# EAGLE schematic hub4 (EAGLE 6.6.0)
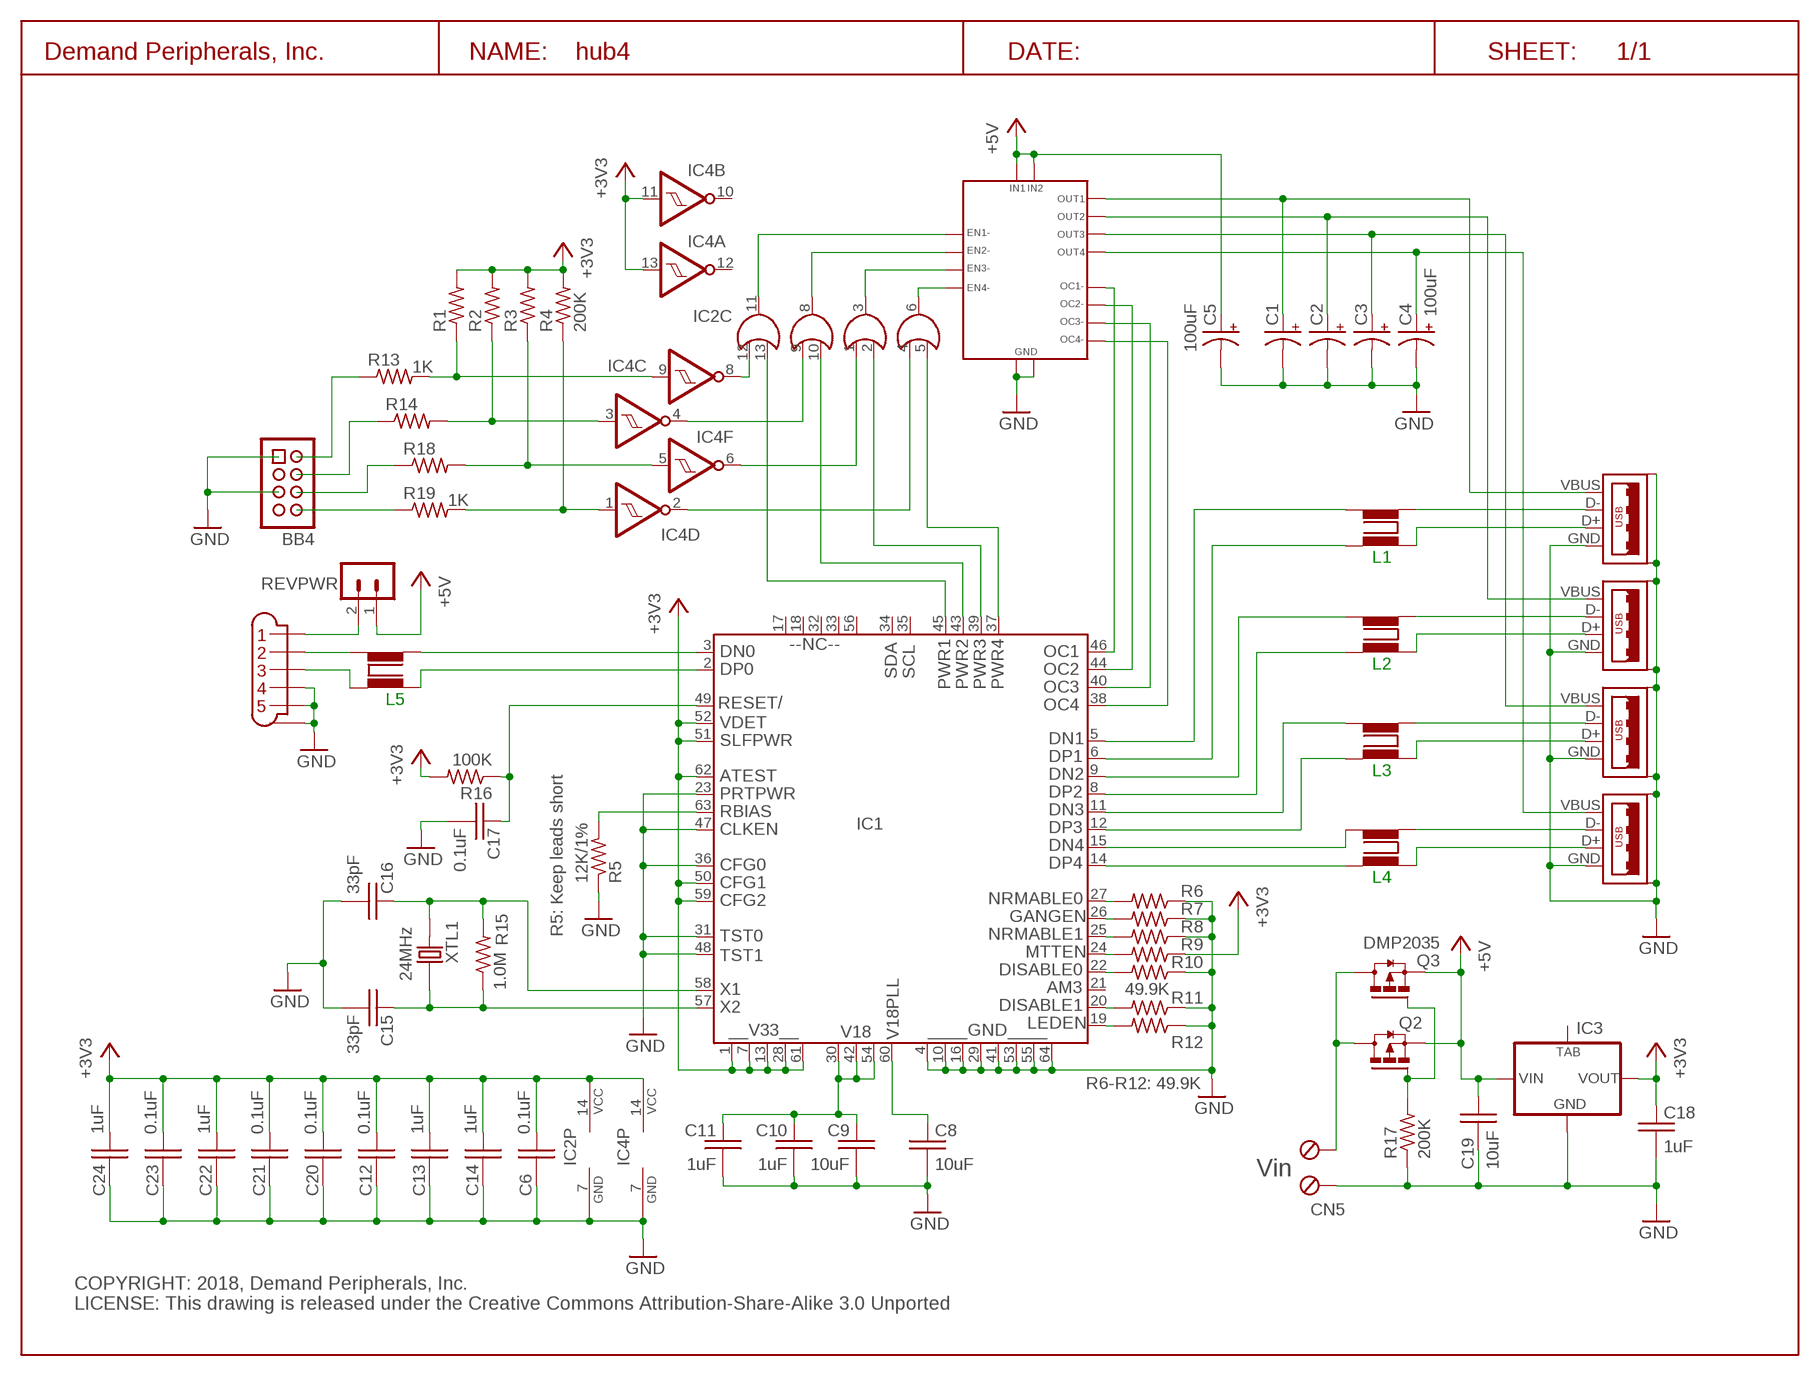
[diagram p0: schematic, sheet 1]

## Parts
BB4  HDR-4X2-SHR  [HDR-4X2]
C1  100uF  C100UF35V_E3.5-8  [E3.5-8]
C2  100uF  C100UF35V_E3.5-8  [E3.5-8]
C3  100uF  C100UF35V_E3.5-8  [E3.5-8]
C4  100uF  C100UF35V_E3.5-8  [E3.5-8]
C5  100uF  C100UF35V_E3.5-8  [E3.5-8]
C6  0.1uF  C0.1UF_C0603  [C0603]
C8  10uF  C10UF35V_C0805  [C0805]
C9  10uF  C10UF35V_C0805  [C0805]
C10  1uF  C1.0UF_C0603  [C0603]
C11  1uF  C1.0UF_C0603  [C0603]
C12  0.1uF  C0.1UF_C0603  [C0603]
C13  1uF  C1.0UF_C0603  [C0603]
C14  1uF  C1.0UF_C0603  [C0603]
C15  33pF  C33PF_C0603  [C0603]
C16  33pF  C33PF_C0603  [C0603]
C17  0.1uF  C0.1UF_C0603  [C0603]
C18  1uF  C1.0UF_C0603  [C0603]
C19  10uF  C10UF35V_C0805  [C0805]
C20  0.1uF  C0.1UF_C0603  [C0603]
C21  0.1uF  C0.1UF_C0603  [C0603]
C22  1uF  C1.0UF_C0603  [C0603]
C23  0.1uF  C0.1UF_C0603  [C0603]
C24  1uF  C1.0UF_C0603  [C0603]
CN1  USB_SINGLETHRU-HOLE  [USB-A_1H]
CN2  USB_SINGLETHRU-HOLE  [USB-A_1H]
CN3  USB_SINGLETHRU-HOLE  [USB-A_1H]
CN4  USB_SINGLETHRU-HOLE  [USB-A_1H]
CN5  TBLK-5.08-X2  [TBLK-5.08-X2]
IC1  USB2504  [TQFP64-10X10]
IC2  7432  [SO14]
IC3  LM1117A  [SOT223]
IC4  7414  [SO14]
IC5  TPS2044  [SO16]
L1  ACM2012  [ACM2012]
L2  ACM2012  [ACM2012]
L3  ACM2012  [ACM2012]
L4  ACM2012  [ACM2012]
L5  ACM2012  [ACM2012]
Q2  DMP2035  [SOT23]
Q3  DMP2035  [SOT23]
R1  200K  R200K_R0603  [R0603]
R2  200K  R200K_R0603  [R0603]
R3  200K  R200K_R0603  [R0603]
R4  200K  R200K_R0603  [R0603]
R5  12K/1%  R12K_R0603  [R0603]
R6  49.9K  R49.9K_R0603  [R0603]
R7  49.9K  R49.9K_R0603  [R0603]
R8  49.9K  R49.9K_R0603  [R0603]
R9  49.9K  R49.9K_R0603  [R0603]
R10  49.9K  R49.9K_R0603  [R0603]
R11  49.9K  R49.9K_R0603  [R0603]
R12  49.9K  R49.9K_R0603  [R0603]
R13  1K  R1K_R0603  [R0603]
R14  1K  R1K_R0603  [R0603]
R15  1.0M  R1M_R0603  [R0603]
R16  100K  R100K_R0603  [R0603]
R17  200K  R200K_R0603  [R0603]
R18  1K  R1K_R0603  [R0603]
R19  1K  R1K_R0603  [R0603]
REVPWR  HDR-2X1-LCK  [HDR-2X1]
U$5  MINI-B  [MINI-B-MOLEX]
U$6  DP_FRAME_L  [LETTER_L]
XTL1  24MHz  HC49S-24MHZ  [HC49S]

## Nets
+3V3: C6.1 C12.1 C13.1 C14.1 C18.1 C20.1 C21.1 C22.1 C23.1 C24.1 IC1.1(V33-0) IC1.7(V33-1) IC1.13(V33-2) IC1.28(V33-3) IC1.50(CFG1) IC1.51(SLFPWR) IC1.52(VDET) IC1.59(CFG2) IC1.61(V33-PLL) IC1.62(ATEST) IC2.14(P:VCC) IC3.2(OUT) IC4.11(B:I) IC4.13(A:I) IC4.14(P:VCC) R1.2 R2.2 R3.2 R4.2 R9.1 R16.2
+5V: C5.+ C19.1 IC3.3(IN) IC5.2(IN1) IC5.6(IN2) Q2.2(S) Q3.2(S) REVPWR.1
GND: BB4.1 BB4.5 C1.- C2.- C3.- C4.- C5.- C6.2 C8.2 C9.2 C10.2 C11.2 C12.2 C13.2 C14.2 C15.2 C16.2 C17.2 C18.2 C19.2 C20.2 C21.2 C22.2 C23.2 C24.2 CN1.GND CN1.P$5 CN1.P$6 CN2.GND CN2.P$5 CN2.P$6 CN3.GND CN3.P$5 CN3.P$6 CN4.GND CN4.P$5 CN4.P$6 CN5.1(KL) IC1.4(VSS0) IC1.10(VSS1) IC1.16(VSS2) IC1.23(PTRPWR) IC1.29(VSS3) IC1.31(TST0) IC1.36(CFG0) IC1.41(VSS4) IC1.47(CLKEN) IC1.48(TST1) IC1.53(VSS5) IC1.55(VSS6) IC1.64(VSS7) IC2.7(P:GND) IC3.1(GND) IC4.7(P:GND) IC5.1(GND1) IC5.5(GND2) R5.1 R6.1 R7.1 R8.1 R10.1 R11.1 R12.1 R17.1 U$5.GND U$5.P$4 U$5.P$5
N$1: CN1.D- L1.P$3
N$2: CN1.D+ L1.P$1
N$3: IC1.14(DP4) L4.P$4
N$4: CN2.D- L2.P$1
N$5: CN2.D+ L2.P$3
N$6: CN3.D- L3.P$3
N$7: CN3.D+ L3.P$1
N$8: CN4.D- L4.P$1
N$9: CN4.D+ L4.P$3
N$10: IC1.15(DN4) L4.P$2
N$11: IC1.12(DP3) L3.P$2
N$12: IC1.11(DN3) L3.P$4
N$13: REVPWR.2 U$5.P$1
N$14: IC1.8(DP2) L2.P$4
N$15: IC1.9(DN2) L2.P$2
N$16: IC1.6(DP1) L1.P$2
N$17: IC1.5(DN1) L1.P$4
N$18: L5.P$3 U$5.P$3
N$19: L5.P$1 U$5.P$2
N$20: IC2.12(D:I0) IC4.8(C:O)
N$21: IC2.9(C:I0) IC4.4(E:O)
N$22: IC2.1(A:I0) IC4.6(F:O)
N$23: IC1.46(OC1) IC5.16(OC1-)
N$24: IC1.44(OC2) IC5.13(OC2-)
N$25: IC1.40(OC3) IC5.12(OC3-)
N$26: IC1.38(OC4) IC5.9(OC4-)
N$27: IC2.4(B:I0) IC4.2(D:O)
N$28: IC1.45(PWR1) IC2.13(D:I1)
N$29: IC1.43(PWR2) IC2.10(C:I1)
N$30: IC1.39(PWR3) IC2.2(A:I1)
N$31: BB4.2 R13.1
N$32: IC1.37(PWR4) IC2.5(B:I1)
N$33: IC2.6(B:O) IC5.8(EN4-)
N$34: IC2.3(A:O) IC5.7(EN3-)
N$35: IC2.8(C:O) IC5.4(EN2-)
N$36: IC2.11(D:O) IC5.3(EN1-)
N$37: IC4.9(C:I) R1.1 R13.2
N$38: C16.1 IC1.58(X1) R15.2 XTL1.P$2
N$39: C1.+ CN1.VBUS IC5.15(OUT1)
N$40: C9.1 C10.1 C11.1 IC1.30(V18-0) IC1.42(V18-1) IC1.54(V18-3)
N$41: CN5.2(KL1) Q2.3(D) Q3.3(D)
N$42: Q2.1(G) Q3.1(G) R17.2
N$43: IC1.63(RBIAS) R5.2
N$44: IC4.3(E:I) R2.1 R14.2
N$45: IC4.5(F:I) R3.1 R18.2
N$46: C8.1 IC1.60(V18PLL)
N$47: IC4.1(D:I) R4.1 R19.2
N$48: C15.1 IC1.57(X2) R15.1 XTL1.P$1
N$49: IC1.27(GR1) R6.2
N$50: C17.1 IC1.49(RESET) R16.1
N$51: IC1.26(AM1) R7.2
N$53: BB4.4 R14.1
N$54: IC1.25(GR2) R8.2
N$55: IC1.24(AM2) R9.2
N$56: BB4.6 R18.1
N$57: BB4.8 R19.1
N$58: IC1.22(GR3) R10.2
N$59: IC1.20(GR4) R11.2
N$60: IC1.19(AM4) R12.2
N$61: IC1.3(DN0) L5.P$2
N$62: IC1.2(DP0) L5.P$4
N$73: C2.+ CN2.VBUS IC5.14(OUT2)
N$74: C3.+ CN3.VBUS IC5.11(OUT3)
N$75: C4.+ CN4.VBUS IC5.10(OUT4)
Unconnected: BB4.3 BB4.7 IC1.17(NC0) IC1.18(NC1) IC1.21(AM3) IC1.32(NC2) IC1.33(NC3) IC1.34(SDA) IC1.35(SCL) IC1.56(NC4) IC3.4(TAB) IC4.10(B:O) IC4.12(A:O)

## Notes on the sheet
- L1
- L2
- L5
- L3
- L4
- R5: Keep leads short
- R6-R12: 49.9K
- Vin
- COPYRIGHT: 2018, Demand Peripherals, Inc.
  LICENSE: This drawing is released under the Creative Commons Attribution-Share-Alike 3.0 Unported

## Library data of the parts
BB4 = dpi-conn:HDR-4X2-SHR: Shrouded 4x2 pin header; VENDOR: Digikey; VENDOR-PART-NUM: 609-3530-ND
C1-C5 = dpi-passive:C100UF35V_: 100uF polarized capacitor, 35 volts, general purpose; VENDOR: Digikey; VENDOR-PART-NUM: 399-6548-ND
C6 C12 C17 C20 C21 C23 = dpi-passive:C0.1UF_: 0.1 uF Capacitor, 25V, X7R; VENDOR: Digikey; VENDOR-PART-NUM: 1276-1126-2-ND
C8 C9 C19 = dpi-passive:C10UF35V_: 10 uF Capacitor, 35V, X6S; VENDOR: Digikey; VENDOR-PART-NUM: 490-10504-2-ND
C10 C11 C13 C14 C18 C22 C24 = dpi-passive:C1.0UF_: 1.0 uF Capacitor, 25V, Y5V; VENDOR: Digikey; VENDOR-PART-NUM: 490-3897-2-ND
C15 C16 = dpi-passive:C33PF_: 33 pF Capacitor, 50V; VENDOR: Digikey; VENDOR-PART-NUM: 1276-1070-2-ND
CN1-CN4 = dpi-conn:USB_SINGLE; VENDOR: Digikey; VENDOR-PART-NUM: AE11191-ND
CN5 = dpi-conn:TBLK-5.08-X2: Terminal Block, 5.08mm, x2, screw terminals; VENDOR: Digikey; VENDOR-PART-NUM: ED2609-ND
IC1 = dpi-transic:USB2504; VENDOR: Digikey; VENDOR-PART-NUM: 638-1031-ND
IC2 = dpi-transic:74*32: Quad 2-input OR; VENDOR: Digikey; VENDOR-PART-NUM: 568-12072-5-ND
IC3 = dpi-transic:LM1117A: 3.3 volt linear regulator; VENDOR: Digikey; VENDOR-PART-NUM: NCP1117LPST33T3GOSCT-ND
IC4 = dpi-transic:74*14: Hex schmitt trigger INVERTER; VENDOR: Digikey; VENDOR-PART-NUM: 568-1401-1-ND
IC5 = dpi-transic:TPS2044: USB Power management chip; VENDOR: Digikey; VENDOR-PART-NUM: 296-26909-1-ND
L1-L5 = dpi-passive:ACM2012: USB in-line filter; VENDOR: Digikey; VENDOR-PART-NUM: 445-2207-1-ND
Q2 Q3 = dpi-transic:DMP2035: PFET; VENDOR: Digikey; VENDOR-PART-NUM: DMP2035U-7DICT-ND
R1-R4 R17 = dpi-passive:R200K_: 200K Resistor, 1%, 0.1 watt; VENDOR: Digikey; VENDOR-PART-NUM: 311-200KHRTR-ND
R5 = dpi-passive:R12K_: 12K Resistor, 1%, 0.1 watt; VENDOR: Digikey; VENDOR-PART-NUM: 311-12.0KHRTR-ND
R6-R12 = dpi-passive:R49.9K_: 49.9K Resistor, 1%, 0.1 watt; VENDOR: Digikey; VENDOR-PART-NUM: 311-49.9KHRTR-ND
R13 R14 R18 R19 = dpi-passive:R1K_: 1K Resistor, 1%, 0.1 watt; VENDOR: Digikey; VENDOR-PART-NUM: 311-1.00KHRTR-ND
R15 = dpi-passive:R1M_: 1M Resistor, 1%, 0.1 watt; VENDOR: Digikey; VENDOR-PART-NUM: 311-1.00MHRTR-ND
R16 = dpi-passive:R100K_: 100K Resistor, 1%, 0.1 watt; VENDOR: Digikey; VENDOR-PART-NUM: 311-100KHRTR-ND
REVPWR = dpi-conn:HDR-2X1-LCK: 2x1 pin header with friction lock; VENDOR: Mouser; VENDOR-PART-NUM: 571-6404562
U$5 = dpi-conn:MINI-B; VENDOR: Mouser; VENDOR-PART-NUM: 538-51387-0530
U$6 = DP:DP_FRAME_L: Landscape/Letter Document Frame
XTL1 = dpi-passive:HC49S-24MHZ: HC49S 24 MHz crystal; VENDOR: Digikey; VENDOR-PART-NUM: 887-2441-1-ND